# Altium project Standard_Chassis_PCB_v1.0.PrjPcb
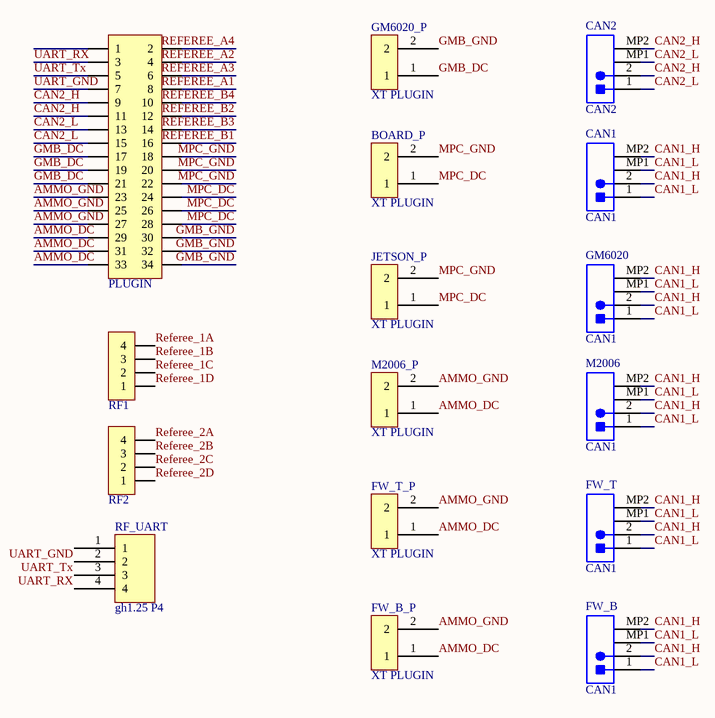
[diagram p0: Standard_Chassis_v1.0.SchDoc]
1 sheet, 16 parts. Net scope: global (net labels, ports and power ports of the same name join across sheets).
Board file: Standard_Chassis_v1.0.PcbDoc

## Sheet Standard_Chassis_v1.0.SchDoc
size A4

### Parts
BOARD_P  XT PLUGIN  [XT30-M]
CAN1  CAN1  [JST-BM02B-GHS-TBT_V]
CAN2  CAN2  [JST-BM02B-GHS-TBT_V]
FW_B  CAN1  [JST-BM02B-GHS-TBT_V]
FW_B_P  XT PLUGIN  [XT30-M]
FW_T  CAN1  [JST-BM02B-GHS-TBT_V]
FW_T_P  XT PLUGIN  [XT30-M]
GM6020  CAN1  [JST-BM02B-GHS-TBT_V]
GM6020_P  XT PLUGIN  [XT30-M]
JETSON_P  XT PLUGIN  [XT30-M]
M2006  CAN1  [JST-BM02B-GHS-TBT_V]
M2006_P  XT PLUGIN  [XT30-M]
PLUGIN  Header 2X11  [IDC2.54-LI-2x17P]  (value not drawn)
RF1  HDR-1X4  [KF2510-LI-4P]  (value not drawn)
RF2  HDR-1X4  [KF2510-LI-4P]  (value not drawn)
RF_UART  gh1.25 P4  [GH1.25-4PIN]

### Nets
AMMO_DC: FW_B_P.1 FW_T_P.1 M2006_P.1 PLUGIN.29 PLUGIN.31 PLUGIN.33
AMMO_GND: FW_B_P.2 FW_T_P.2 M2006_P.2 PLUGIN.23 PLUGIN.25 PLUGIN.27
CAN1_H: CAN1.2 CAN1.MP2 FW_B.2 FW_B.MP2 FW_T.2 FW_T.MP2 GM6020.2 GM6020.MP2 M2006.2 M2006.MP2
CAN1_L: CAN1.1 CAN1.MP1 FW_B.1 FW_B.MP1 FW_T.1 FW_T.MP1 GM6020.1 GM6020.MP1 M2006.1 M2006.MP1
CAN2_H: CAN2.2 CAN2.MP2 PLUGIN.9 PLUGIN.11
CAN2_L: CAN2.1 CAN2.MP1 PLUGIN.13 PLUGIN.15
GMB_DC: GM6020_P.1 PLUGIN.17 PLUGIN.19 PLUGIN.21
GMB_GND: GM6020_P.2 PLUGIN.30 PLUGIN.32 PLUGIN.34
MPC_DC: BOARD_P.1 JETSON_P.1 PLUGIN.24 PLUGIN.26 PLUGIN.28
MPC_GND: BOARD_P.2 JETSON_P.2 PLUGIN.18 PLUGIN.20 PLUGIN.22
Referee_1A: RF1.4
Referee_1B: RF1.3
Referee_1C: RF1.2
Referee_1D: RF1.1
Referee_2A: RF2.4
Referee_2B: RF2.3
Referee_2C: RF2.2
Referee_2D: RF2.1
REFEREE_A1: PLUGIN.8
REFEREE_A2: PLUGIN.4
REFEREE_A3: PLUGIN.6
REFEREE_A4: PLUGIN.2
REFEREE_B1: PLUGIN.16
REFEREE_B2: PLUGIN.12
REFEREE_B3: PLUGIN.14
REFEREE_B4: PLUGIN.10
UART_GND: PLUGIN.7 RF_UART.2
UART_RX: PLUGIN.3 RF_UART.4
UART_Tx: PLUGIN.5 RF_UART.3

Not connected (* = marked no-connect by the designer): PLUGIN 1; RF_UART 1

### Library data of the parts
CAN1 CAN2 FW_B FW_T GM6020 M2006 = CMP-2000-05957-1: Disconnectable Crimp Style Connector, Pitch 1.25 mm, 1 x 2 Position, Height 4.05 mm, -25 to 85 degC, RoHS, Tape and Reel; Manufacturer: JST-Sales-America-Inc.; Connector Type: Header,Shrouded; Number of Positions Loaded: All; Pitch: 0.049"(1.25mm); Number of Positions: 2; Family: RectangularConnectors-Headers,MalePins; Contact Finish: Tin; Contact Type: OuterShroudContact; Number of Rows: 1; Row Spacing: -; Datasheet Version: 05/2016; Fastening Type: LockingRamp; Contact Mating Length: -; Packaging: Digi-Reel®; Manufacturer URL: http://www.jst.com/home2.html; Termination: Solder; Package Description: Disconnectable Crimp Style Connector, Pitch 1.25 mm, 1 x 2 Position, Height 4.05 mm; Features: SolderRetention; Color: Natural; Datasheet URL: http://www.jst-mfg.com/product/pdf/eng/eGH.pdf; Package Reference: BM02B-GHS-TBT; Series: GH; Contact Finish Thickness: -; Mounting Type: SurfaceMount; Mounting Technology: SurfaceMount; Category: Connectors,Interconnects
PLUGIN = Header 17X2: 17*2P接插件; 版权归属: 封装库来自淘宝 ID：黄晶宝石; BOM名称: 17*2P接插件; 学习资源: https://shop463601444.taobao.com
RF1 RF2 = Header 4: 4P接插件; 版权归属: 封装库来自淘宝 ID：黄晶宝石; BOM名称: 4P接插件; 学习资源: https://shop463601444.taobao.com